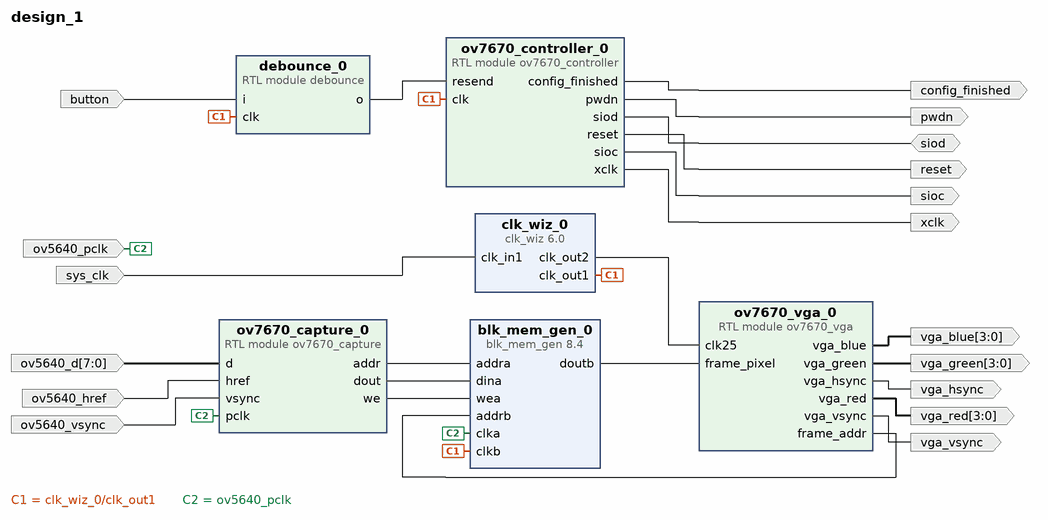
[diagram p0: block diagram of the top level]
# Vivado block design design_1, xc7a100tcsg324-1, Vivado 2023.2
create_bd_design design_1

create_bd_port -dir I button
create_bd_port -dir I sys_clk
create_bd_port -dir I ov5640_pclk
create_bd_port -dir I ov5640_vsync
create_bd_port -dir I ov5640_href
create_bd_port -dir I -from 7 -to 0 ov5640_d
create_bd_port -dir O config_finished
create_bd_port -dir O sioc
create_bd_port -dir IO siod
create_bd_port -dir O xclk
create_bd_port -dir O -from 3 -to 0 vga_red
create_bd_port -dir O -from 3 -to 0 vga_green
create_bd_port -dir O -from 3 -to 0 vga_blue
create_bd_port -dir O vga_hsync
create_bd_port -dir O vga_vsync
create_bd_port -dir O reset
create_bd_port -dir O pwdn

create_bd_cell -type ip -vlnv xilinx.com:ip:blk_mem_gen:8.4 blk_mem_gen_0
set_property -dict [list \
  CONFIG.Enable_A Always_Enabled \
  CONFIG.Memory_Type Simple_Dual_Port_RAM \
  CONFIG.Write_Depth_A 153600 \
  CONFIG.Write_Width_A 12 \
  CONFIG.use_bram_block Stand_Alone \
] [get_bd_cells blk_mem_gen_0]
create_bd_cell -type module -reference debounce debounce_0
create_bd_cell -type module -reference ov7670_capture ov7670_capture_0
create_bd_cell -type module -reference ov7670_controller ov7670_controller_0
create_bd_cell -type module -reference ov7670_vga ov7670_vga_0
create_bd_cell -type ip -vlnv xilinx.com:ip:clk_wiz:6.0 clk_wiz_0
set_property -dict [list \
  CONFIG.CLKOUT1_DRIVES BUFG \
  CONFIG.CLKOUT1_JITTER 130.958 \
  CONFIG.CLKOUT1_PHASE_ERROR 98.575 \
  CONFIG.CLKOUT1_REQUESTED_OUT_FREQ 100.000 \
  CONFIG.CLKOUT2_DRIVES BUFG \
  CONFIG.CLKOUT2_JITTER 175.402 \
  CONFIG.CLKOUT2_PHASE_ERROR 98.575 \
  CONFIG.CLKOUT2_REQUESTED_OUT_FREQ 25 \
  CONFIG.CLKOUT2_USED true \
  CONFIG.CLKOUT3_DRIVES BUFG \
  CONFIG.CLKOUT4_DRIVES BUFG \
  CONFIG.CLKOUT5_DRIVES BUFG \
  CONFIG.CLKOUT6_DRIVES BUFG \
  CONFIG.CLKOUT7_DRIVES BUFG \
  CONFIG.ENABLE_CLOCK_MONITOR false \
  CONFIG.FEEDBACK_SOURCE FDBK_AUTO \
  CONFIG.MMCM_BANDWIDTH OPTIMIZED \
  CONFIG.MMCM_CLKFBOUT_MULT_F 10.000 \
  CONFIG.MMCM_CLKOUT0_DIVIDE_F 10.000 \
  CONFIG.MMCM_CLKOUT1_DIVIDE 40 \
  CONFIG.MMCM_COMPENSATION ZHOLD \
  CONFIG.MMCM_DIVCLK_DIVIDE 1 \
  CONFIG.NUM_OUT_CLKS 2 \
  CONFIG.PRIMITIVE MMCM \
  CONFIG.SECONDARY_SOURCE Single_ended_clock_capable_pin \
  CONFIG.USE_FREQ_SYNTH true \
  CONFIG.USE_PHASE_ALIGNMENT true \
] [get_bd_cells clk_wiz_0]

# ---- connections ----

connect_bd_net [get_bd_pins clk_wiz_0/clk_out1] [get_bd_pins debounce_0/clk] [get_bd_pins blk_mem_gen_0/clkb] [get_bd_pins ov7670_controller_0/clk]
connect_bd_net [get_bd_ports ov5640_pclk] [get_bd_pins blk_mem_gen_0/clka] [get_bd_pins ov7670_capture_0/pclk]
connect_bd_net [get_bd_ports siod] [get_bd_pins ov7670_controller_0/siod]
connect_bd_net [get_bd_pins blk_mem_gen_0/doutb] [get_bd_pins ov7670_vga_0/frame_pixel]
connect_bd_net [get_bd_ports button] [get_bd_pins debounce_0/i]
connect_bd_net [get_bd_pins clk_wiz_0/clk_out2] [get_bd_pins ov7670_vga_0/clk25]
connect_bd_net -net d_1 [get_bd_ports ov5640_d] [get_bd_pins ov7670_capture_0/d]
connect_bd_net [get_bd_pins debounce_0/o] [get_bd_pins ov7670_controller_0/resend]
connect_bd_net -net href_1 [get_bd_ports ov5640_href] [get_bd_pins ov7670_capture_0/href]
connect_bd_net [get_bd_pins ov7670_capture_0/addr] [get_bd_pins blk_mem_gen_0/addra]
connect_bd_net [get_bd_pins ov7670_capture_0/dout] [get_bd_pins blk_mem_gen_0/dina]
connect_bd_net [get_bd_pins ov7670_capture_0/we] [get_bd_pins blk_mem_gen_0/wea]
connect_bd_net [get_bd_pins ov7670_controller_0/config_finished] [get_bd_ports config_finished]
connect_bd_net [get_bd_pins ov7670_controller_0/pwdn] [get_bd_ports pwdn]
connect_bd_net [get_bd_pins ov7670_controller_0/reset] [get_bd_ports reset]
connect_bd_net [get_bd_pins ov7670_controller_0/sioc] [get_bd_ports sioc]
connect_bd_net [get_bd_pins ov7670_controller_0/xclk] [get_bd_ports xclk]
connect_bd_net [get_bd_pins ov7670_vga_0/frame_addr] [get_bd_pins blk_mem_gen_0/addrb]
connect_bd_net [get_bd_pins ov7670_vga_0/vga_blue] [get_bd_ports vga_blue]
connect_bd_net [get_bd_pins ov7670_vga_0/vga_green] [get_bd_ports vga_green]
connect_bd_net [get_bd_pins ov7670_vga_0/vga_hsync] [get_bd_ports vga_hsync]
connect_bd_net [get_bd_pins ov7670_vga_0/vga_red] [get_bd_ports vga_red]
connect_bd_net [get_bd_pins ov7670_vga_0/vga_vsync] [get_bd_ports vga_vsync]
connect_bd_net -net sys_clock_1 [get_bd_ports sys_clk] [get_bd_pins clk_wiz_0/clk_in1]
connect_bd_net -net vsync_1 [get_bd_ports ov5640_vsync] [get_bd_pins ov7670_capture_0/vsync]

validate_bd_design
save_bd_design
